# EasyEDA Pro project ProProject_无线温湿度检测系统1_2024-10-27.epro, board PCB5
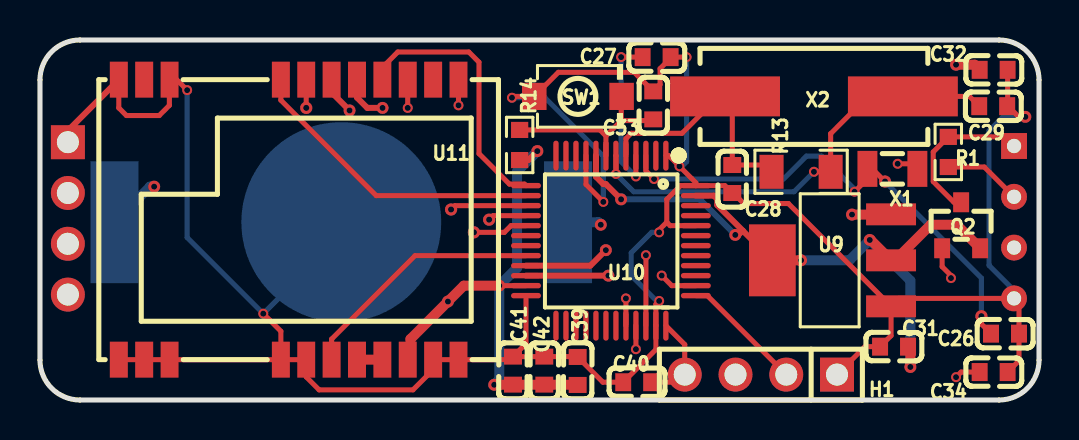
[diagram p7: board, top side]
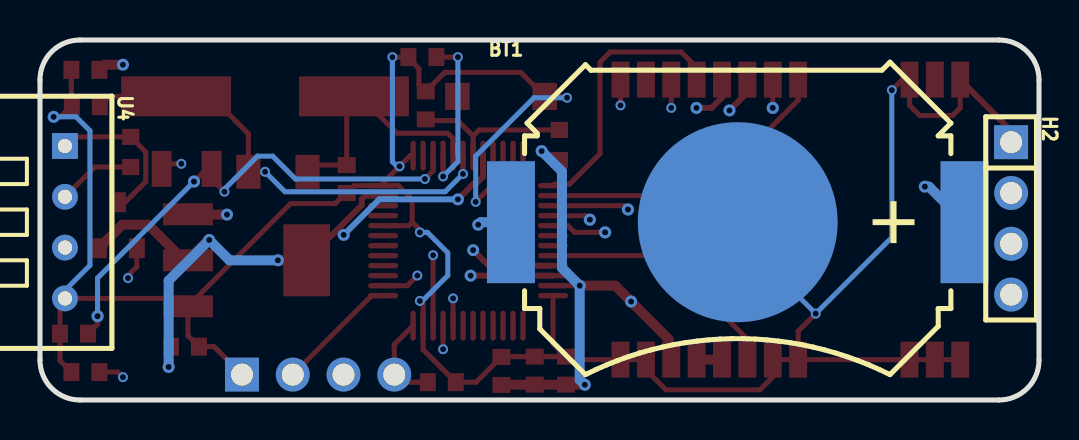
[diagram p8: board, bottom side, seen from below]

Outline 50 x 18 mm; copper layers: Top Layer, Inner1, Inner2, Bottom Layer. Coordinates in mm from the lower left corner of the outline.
Outline path: 0,16 0,2 arc(0.59,0.59) 2,0 48,0 arc(49.41,0.59) 50,2 50,16 arc(49.41,17.41) 48,18 2,18 arc(0.59,17.41) 0,16
Stack: Top Layer 0.035mm 外层铜厚1oz / Dielectric1 0.2104mm 7628 RC49% 8.6mil / Inner1 0.0152mm 内层铜厚 / Dielectric2 1.065mm 1.1mm H/HOZ 含铜 / Inner2 0.0152mm 内层铜厚 / Dielectric3 0.2104mm 7628 RC49% 8.6mil / Bottom Layer 0.035mm 外层铜厚1oz

## Design rules (mm)
template: JLCPCB Capability(Two Layers Board)
spacing copperThickness1oz (default): track to track 0.102, other pairs 0.152 to 0.3
spacing copperThickness2oz: track to track 0.203, other pairs 0.152 to 0.3
track width copperThickness1oz (default): min 0.127, default 0.254, max 2.54
track width copperThickness2oz: min 0.203, default 0.254, max 2.54
differential pair differentialPair (default): width min 0.127, default 0.254, max 2.54; gap min 0.152, default 0.152
via viaSize (default): diameter min 0.5, default 0.61, max 10; hole min 0.3, default 0.305, max 6.3

## Placement (name value [footprint] x y rotation side)
BT1  MY-2032-12  [BAT-SMD_MY-2032-12]  15.08 8.89 180 bottom
C26  20pF  [C0603]  48.3 3.32 180 top
C27  20pF  [C0603]  30.86 17.14 180 top
C28  20pF  [C0603]  34.65 11.05 90 top
C29  20pF  [C0603]  47.71 14.69 180 top
C31  1uF  [C0603]  42.74 2.67 0 top
C32  1uF  [C0603]  47.73 16.51 180 top
C33  1uF  [C0603]  30.69 14.73 270 top
C34  100nF  [C0603]  47.73 1.4 180 top
C39  100nF  [C0603]  26.91 1.45 270 top
C40  100nF  [C0603]  29.89 0.89 0 top
C41  100nF  [C0603]  23.67 1.47 90 top
C42  100nF  [C0603]  25.24 1.47 90 top
H1  PZ254V-11-04P  [HDR-TH_4P-P2.54-V-M]  36.08 1.27 180 top
H2  PZ254V-11-04P  [HDR-TH_4P-P2.54-V-M]  1.4 9.08 270 bottom
Q2  AO3401A  [SOT-23_L2.9-W1.3-P1.90-LS2.4-BR]  46.1 8.74 270 top
R1  4.7kΩ  [R0603]  45.46 12.4 90 top
R13  1mΩ  [R1206]  38.09 11.41 180 top
R14  10kΩ  [R0603]  24.01 12.75 270 top
SW1  TS-1088-AR02016  [SW-SMD_L3.9-W3.0-P4.45]  26.92 15.18 0 top
U4  DHT11  [SENSOR-TH_DHT11]  48.75 8.89 270 bottom
U9  BL8072CLTR33  [SOT-223-3_L6.5-W3.4-P2.30-LS7.0-BR]  39.62 6.98 0 top
U10  STM32L051C8T6  [LQFP-48_L7.0-W7.0-P0.50-LS9.0-BL]  28.58 7.97 180 top
U11  E22-400M22S  [WIRELM-SMD_E22-400M22S]  12.45 9.02 270 top
X1  32.768kHz  [FC-135R_L3.2-W1.5]  42.66 11.56 180 top
X2  8MHz  [CRYSTAL-SMD_L11.5-W4.8-LS12.7]  38.73 15.18 0 top

## Footprints (pads in the part's own frame, mm; a bottom-side part is the same pattern mirrored in y, then rotated)
BAT-SMD_MY-2032-12
  rect 2.4x6.1 smd: 1(-11.35,0) 1(11.35,0)
  round 10 smd: 2(0,0)
C0603
  rect 0.8x0.9 smd: 1(-0.7,0) 2(0.7,0)
CRYSTAL-SMD_L11.5-W4.8-LS12.7
  rect 5.5x2 smd: 1(-4.45,0) 2(4.45,0)
FC-135R_L3.2-W1.5
  rect 1x1.8 smd: 1(-1.25,0) 2(1.25,0)
HDR-TH_4P-P2.54-V-M
  rect 1.7x1.7 hole 1.1: 1(-3.81,0)
  round 1.7 hole 1.1: 2(-1.27,0) 3(1.27,0) 4(3.81,0)
LQFP-48_L7.0-W7.0-P0.50-LS9.0-BL
  oval 0.27x1.5 smd: 1(-2.75,-4.25) 2(-2.25,-4.25) 3(-1.75,-4.25) 4(-1.25,-4.25) 5(-0.75,-4.25) 6(-0.25,-4.25) 7(0.25,-4.25) 8(0.75,-4.25) 9(1.25,-4.25) 10(1.75,-4.25) 11(2.25,-4.25) 12(2.75,-4.25) 25(2.75,4.25) 26(2.25,4.25) 27(1.75,4.25) 28(1.25,4.25) 29(0.75,4.25) 30(0.25,4.25) 31(-0.25,4.25) 32(-0.75,4.25) 33(-1.25,4.25) 34(-1.75,4.25) 35(-2.25,4.25) 36(-2.75,4.25)
  oval 1.5x0.27 smd: 13(4.25,-2.75) 14(4.25,-2.25) 15(4.25,-1.75) 16(4.25,-1.25) 17(4.25,-0.75) 18(4.25,-0.25) 19(4.25,0.25) 20(4.25,0.75) 21(4.25,1.25) 22(4.25,1.75) 23(4.25,2.25) 24(4.25,2.75) 37(-4.25,2.75) 38(-4.25,2.25) 39(-4.25,1.75) 40(-4.25,1.25) 41(-4.25,0.75) 42(-4.25,0.25) 43(-4.25,-0.25) 44(-4.25,-0.75) 45(-4.25,-1.25) 46(-4.25,-1.75) 47(-4.25,-2.25) 48(-4.25,-2.75)
R0603
  rect 0.806x0.864 smd: 1(-0.753,0) 2(0.753,0)
R1206
  rect 1.208x1.701 smd: 1(-1.479,0) 2(1.479,0)
SENSOR-TH_DHT11
  rect 1.296x1.296 hole 0.711: 1(-3.81,0)
  round 1.296 hole 0.711: 2(-1.27,0) 3(1.27,0) 4(3.81,0)
SOT-23_L2.9-W1.3-P1.90-LS2.4-BR
  rect 1x0.8 smd: 1(1.15,-0.95) 2(1.15,0.95) 3(-1.15,0)
SOT-223-3_L6.5-W3.4-P2.30-LS7.0-BR
  rect 2.5x1.1 smd: 1(2.97,-2.3) 2(2.97,0) 3(2.97,2.3)
  rect 2.34x3.6 smd: 4(-2.97,0)
SW-SMD_L3.9-W3.0-P4.45
  rect 1.23x1.36 smd: 1(-2.185,0) 2(2.185,0)
WIRELM-SMD_E22-400M22S
  rect 1.8x0.9 smd: 1(7,-8.5) 2(7,-7.23) 3(7,-5.96) 4(7,-0.39) 5(7,0.88) 6(7,2.15) 7(7,3.42) 8(7,4.69) 9(7,5.96) 10(7,7.23) 11(7,8.5) 12(-7,8.5) 13(-7,7.23) 14(-7,5.96) 15(-7,4.69) 16(-7,3.42) 17(-7,2.15) 18(-7,0.88) 19(-7,-0.39) 20(-7,-5.96) 21(-7,-7.23) 22(-7,-8.5)

## Nets
As in the schematic.

Pads without a net: U4 3; U10 2 10 11 12 18 19 25 26 27 28 29 30 31 39 40 41 42 43 45 46; U11 13 21

## Via types
v1: diameter 0.5, hole 0.3, Top Layer to Bottom Layer, 23 vias
v2: diameter 0.6, hole 0.3, Top Layer to Bottom Layer, 18 vias
v3: diameter 0.61, hole 0.305, Top Layer to Bottom Layer, 6 vias

## Routing (per net, layer and track width the routed paths; a pad name or vN(x,y) marks a point on that pad's centre or on a via; arc(x,y) is an arc through that point)
GND: length 153.7
  Top Layer w0.254: 31.37,8.89 31.37,10.03 32.05,10.72 U10.48 ; 31.37,8.89 31.54,8.72 U10.44 ; 31.37,8.89 30.99,8.51 v1(30.99,8.38) ; U11.4 U11.5 13.33,1.15 13.97,0.51 18.67,0.51 19.43,1.27 19.43,1.77 19.68,2.02 U11.11 23.52,2.02 C41.2 ; U11.4 12.06,3.44 v1(11.18,4.32) ; U11.4 U11.3 U11.1 ; v1(30.99,4.95) 30.83,4.79 U10.35 30.83,2.52 29.19,0.89 28.17,0.89 C39.1 26.89,2.17 C42.2 C41.2 ; U10.48 34.28,10.72 C28.1 34.7,10.35 35.22,9.82 37.46,9.82 U9.1 ; U10.48 32.83,10.86 v1(32,11.68) 31.47,12.22 U10.1 ; C32.1 48.43,14.71 ; 48.43,14.71 C29.1 ; 48.43,14.71 48.98,14.16 v2(49.31,14.16) ; U9.1 42.99,5.08 U4.4 49,4.83 C26.1 49,1.97 C34.1 ; U9.1 42.59,3.22 C31.1 41.29,2.67 H1.1 ; U11.12 v1(20.95,14.73) ; C41.2 24.33,2.82 U10.24 ; v1(28.19,9.91) 27.33,10.78 U10.9 ; v1(23.62,15.11) 23.69,15.18 SW1.1 25.94,16.38 29.74,16.38 C33.1 31.03,15.77 31.03,16.57 31.56,17.09 C27.1 32.36,17.14 v1(32.36,17.14) ; U11.22 3.95,14.61 4.33,14.22 5.97,14.22 6.48,14.73 6.48,16.01 U11.20 6.84,16.02 v1(7.37,15.49)
  Top Layer w0.3: H2.1 1.4,13.47 U11.22
  Inner1 w0.254: v1(20.95,14.73) 23.24,14.73 v1(23.62,15.11)
  Bottom Layer w0.254: v2(49.31,14.16) 48.19,14.16 47.5,13.46 47.5,6.73 48.75,5.48 U4.4 ; 32,11.56 32.36,11.92 v1(32.36,17.14) ; BT1.2 15.08,8.22 v1(11.18,4.32) 7.37,8.13 v1(7.37,15.49) ; v1(30.99,8.38) 30.61,8.38 29.59,7.36 29.59,6.22 30.86,4.95 v1(30.99,4.95) ; v1(23.62,15.11) 25.27,15.11 28.19,12.19 v1(28.19,9.91)
VCC: length 88
  Top Layer w0.254: 23.67,0.76 C41.1 ; U10.23 v2(22.99,5.72) ; 25.23,0.76 C42.1
  Top Layer w0.3: U10.47 33.73,10.22 33.89,10.05 33.89,9.74 35.17,8.47 ; U10.8 27.83,11.16 28.19,10.8 28.32,10.8 v2(29.08,10.03) ; 24.01,12 24.44,12 v2(24.89,12.45) ; 35.17,8.47 36.65,6.98 ; 35.17,8.47 34.95,8.25 v2(34.8,8.25)
  Top Layer w0.5: C39.2 26.9,0.76 v2(22.73,0.76) ; U11.9 18.54,2.15 18.54,3.05 v2(20.42,4.92) 21.21,5.72 v2(22.99,5.72) ; 43.44,2.67 43.56,2.55 v2(43.56,1.65) ; Q2.2 45.88,8.76 44.58,8.76 42.8,6.98 U9.2 41.58,8 v2(41.53,8) ; v2(38.09,6.98) 36.65,6.98
  Inner1 w0.5: v2(20.42,4.92) 19.5,5.84 8.38,5.84 3.87,10.35 H2.2 ; v2(24.89,12.45) 26.67,12.45 v2(29.08,10.03)
  Bottom Layer w0.3: v2(34.8,8.25) 33.02,10.03 v2(29.08,10.03)
  Bottom Layer w0.5: v2(24.89,12.45) 23.88,11.43 23.88,6.61 v2(22.99,5.72) 22.99,1.02 v2(22.73,0.76) ; v2(38.09,6.98) 40.51,6.98 v2(41.53,8) 43.56,5.97 v2(43.56,1.65)
VDDIO2: length 20.7
  Top Layer w0.254: C34.2 46.1,1.4 v1(45.85,1.14) ; C40.2 31.89,0.89 H1.4 32.27,2.77 U10.36
  Inner1 w0.254: v1(45.85,1.14) 44.32,2.67 33.67,2.67 H1.4
B_VCC: length 55.7
  Top Layer w0.5: v2(45.85,16.76) 46.77,16.76 C32.2 ; U9.3 42.58,9.27 v2(40.64,9.27)
  Inner1 w0.5: v2(45.85,16.76) 43.94,14.86 43.94,10.92 42.29,9.27 v2(40.64,9.27) 28.58,9.27 v2(28.07,8.76) 26.29,6.98 9.4,6.98 v2(5.71,10.67)
  Bottom Layer w0.5: v2(5.71,10.67) 5.51,10.67 3.73,8.89 ; v2(28.07,8.76) 27.94,8.89 BT1.1
DATA: length 25.1
  Top Layer w0.254: U10.38 31.62,5.72 v1(31.11,6.22) ; U4.2 47.26,11.65 R1.1
  Inner1 w0.254: v1(31.11,6.22) 44.81,6.22 U4.2
DHT11_VCC: length 7.9
  Top Layer w0.254: Q2.3 45.74,9.89 44.7,10.92 44.7,12.4 R1.2 48.29,13.16 U4.1
NRST: length 9.4
  Top Layer w0.254: SW1.2 29.09,15.16 29.09,13.97 ; 28.33,13.2 29.09,13.97 ; 28.33,13.2 28.02,13.5 R14.1 ; 28.33,13.2 U10.7 ; 29.09,13.97 30.63,13.97 C33.2
PA3/NRST: length 13.6
  Top Layer w0.254: U11.15 17.14,16.63 17.91,17.4 21.46,17.4 21.97,16.89 21.97,12.32 23.49,10.8 24.25,10.8 U10.13
PA4/SPI1_NSS: length 15.3
  Top Layer w0.254: U11.19 12.06,14.99 16.83,10.22 U10.14
PA5/SPI1_SCK: length 14.6
  Top Layer w0.254: U11.18 v3(13.33,14.61) ; v3(20.57,9.53) 20.77,9.72 U10.15
  Inner1 w0.254: v3(13.33,14.61) 18.41,9.53 v3(20.57,9.53)
PA6/SPI1_MISO: length 13.1
  Top Layer w0.254: v3(22.48,9.02) 22.68,9.22 U10.16
  Top Layer w0.3: v2(15.49,14.48) 14.6,15.38 U11.17
  Inner2 w0.3: v3(22.48,9.02) 20.7,10.8 19.18,10.8 v2(15.49,14.48)
PA7/SPI1_MOSI: length 13.3
  Top Layer w0.254: U10.17 23.58,8.72 23.24,8.38 v3(21.72,8.38)
  Top Layer w0.3: U11.16 15.87,15.12 16.38,14.61 v2(17.14,14.61)
  Inner1 w0.3: v3(21.72,8.38) 21.72,10.03 v2(17.14,14.61)
PA11/BUSY: length 17.6
  Top Layer w0.254: U10.32 v1(29.33,5.08) ; U11.14 v1(18.41,14.61)
  Inner2 w0.254: v1(18.41,14.61) 27.93,5.08 v1(29.33,5.08)
PA12_DHT11_VCC: length 20.3
  Top Layer w0.254: U10.33 v1(29.83,2.54) ; v1(45.59,6.1) 45.59,6.22 45.15,6.67 Q2.1
  Inner1 w0.254: v1(45.59,6.1) 45.59,5.72 42.9,3.02 33.52,3.02 33.04,2.54 v1(29.83,2.54)
PB2/RXEN: length 12.5
  Top Layer w0.254: U11.6 14.6,3.04 18.77,7.22 U10.20
PB10/I2C2_SCL: length 34.1
  Top Layer w0.3: U10.21 27.55,6.72 v2(28.32,7.49)
  Inner1 w0.3: v2(28.32,7.49) 25.02,4.19 20.07,4.19 18.92,5.33 8,5.33 5.52,7.81 H2.3
PB11/I2C2_SDA: length 32.8
  Top Layer w0.3: U10.22 v2(28.45,6.22)
  Inner1 w0.3: v2(28.45,6.22) 27.5,5.27 26.67,5.27 25.19,3.79 19.9,3.79 18.76,4.93 7.83,4.93 7.5,5.27 H2.4
PC14/OSC32_IN: length 25
  Top Layer w0.254: v3(42.29,10.92) 41.66,11.56 X1.2 41.41,11.06 v1(40.77,10.41) ; U10.3 30.33,11.46 v1(30.73,11.05) ; C26.2 47.12,3.8 v3(47.12,4.19)
  Bottom Layer w0.254: v1(30.73,11.05) 37.21,11.05 38.35,12.19 39.12,12.19 40.77,10.54 v1(40.77,10.41) ; v3(47.12,4.19) 47.12,6.1 v3(42.29,10.92)
PC15/OSC32_OUT: length 23.3
  Top Layer w0.254: X1.1 43.66,11.81 v1(42.93,11.81) ; U10.4 v1(29.83,11.18) ; C27.2 v1(29.08,17.14)
  Inner1 w0.254: v1(29.83,11.18) 30.97,12.32 42.42,12.32 v1(42.93,11.81)
  Bottom Layer w0.254: v1(29.83,11.18) 29.08,11.92 v1(29.08,17.14)
PD0/OSC_IN: length 12.4
  Top Layer w0.254: U10.5 29.33,13.07 29.59,13.33 32.13,13.33 33.98,15.18 X2.1 34.65,14.82 34.65,11.75 36.27,11.75 R13.2
PD1/OSC_OUT: length 22.8
  Top Layer w0.254: v1(28.83,11.3) 28.83,12.21 U10.6 ; v1(38.73,11.41) R13.1 39.57,13.32 41.43,15.18 X2.2 46.52,15.18 C29.2
  Bottom Layer w0.254: v1(38.73,11.41) 37.74,10.41 29.72,10.41 v1(28.83,11.3)
SWDCLK: length 6.2
  Top Layer w0.254: U10.37 33.4,5.22 H1.2
SWDIO: length 12
  Top Layer w0.254: U10.34 v1(30.33,7.24)
  Inner2 w0.254: v1(30.33,7.24) 31.37,7.24 34.81,3.8 H1.3
$1N9638: length 1.3
  Top Layer w0.5: U11.7 U11.8
